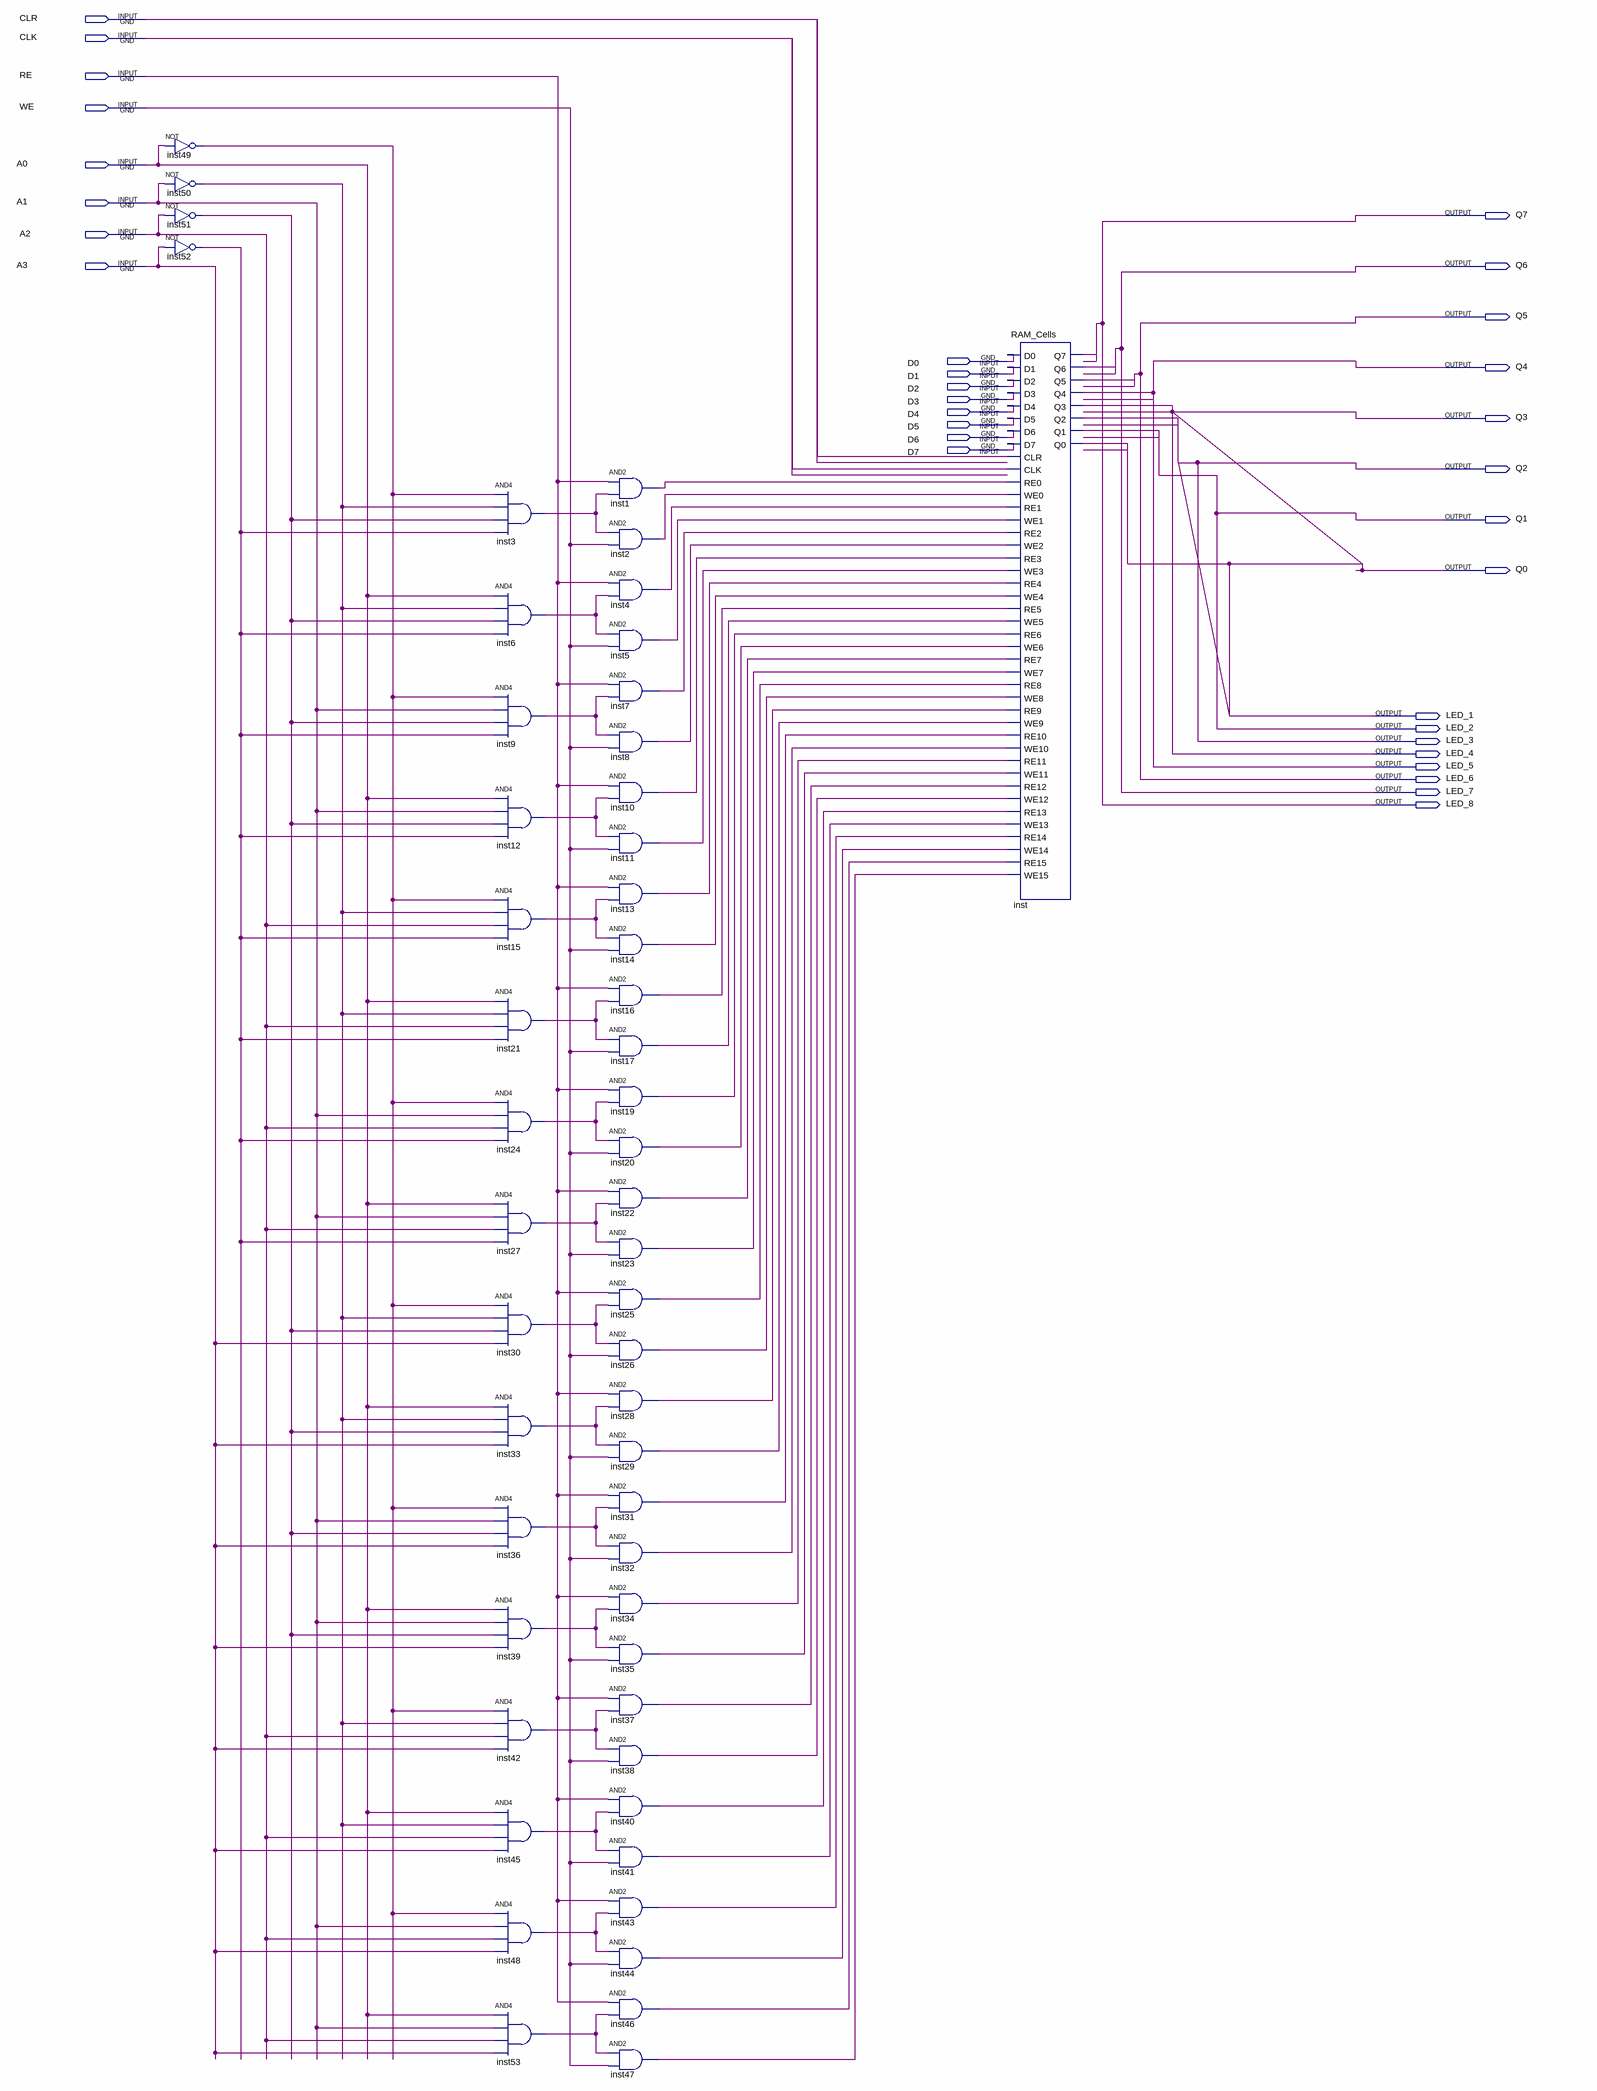
[diagram p0: schematic sheet]
// Quartus schematic RAM.bdf as structural Verilog: 53 symbols, 32 pins
module RAM (
  input  CLR,
  input  CLK,
  input  RE,
  input  WE,
  input  A0,
  input  A1,
  input  A2,
  input  A3,
  input  D0,
  input  D1,
  input  D2,
  input  D3,
  input  D4,
  input  D5,
  input  D6,
  input  D7,
  output Q7,
  output Q6,
  output Q5,
  output Q4,
  output Q3,
  output Q2,
  output Q1,
  output Q0,
  output LED_1,
  output LED_2,
  output LED_3,
  output LED_4,
  output LED_5,
  output LED_6,
  output LED_7,
  output LED_8
);

  wire inst1_out, inst2_out, inst3_out, inst4_out, inst5_out, inst6_out, inst7_out, inst8_out, inst9_out,
       inst10_out, inst11_out, inst12_out, inst13_out, inst14_out, inst15_out, inst16_out, inst17_out,
       inst19_out, inst20_out, inst21_out, inst22_out, inst23_out, inst24_out, inst25_out, inst26_out,
       inst27_out, inst28_out, inst29_out, inst30_out, inst31_out, inst32_out, inst33_out, inst34_out,
       inst35_out, inst36_out, inst37_out, inst38_out, inst39_out, inst40_out, inst41_out, inst42_out,
       inst43_out, inst44_out, inst45_out, inst46_out, inst47_out, inst48_out, inst49_out, inst50_out,
       inst51_out, inst52_out, inst53_out;

  not inst49 (inst49_out, A0);
  not inst50 (inst50_out, A1);
  not inst51 (inst51_out, A2);
  not inst52 (inst52_out, A3);
  and inst3 (inst3_out, inst49_out, inst50_out, inst51_out, inst52_out);
  and inst6 (inst6_out, A0, inst50_out, inst51_out, inst52_out);
  and inst9 (inst9_out, inst49_out, A1, inst51_out, inst52_out);
  and inst12 (inst12_out, A0, A1, inst51_out, inst52_out);
  and inst15 (inst15_out, inst49_out, inst50_out, A2, inst52_out);
  and inst21 (inst21_out, A0, inst50_out, A2, inst52_out);
  and inst24 (inst24_out, inst49_out, A1, A2, inst52_out);
  and inst27 (inst27_out, A0, A1, A2, inst52_out);
  and inst30 (inst30_out, inst49_out, inst50_out, inst51_out, A3);
  and inst33 (inst33_out, A0, inst50_out, inst51_out, A3);
  and inst36 (inst36_out, inst49_out, A1, inst51_out, A3);
  and inst39 (inst39_out, A0, A1, inst51_out, A3);
  and inst42 (inst42_out, inst49_out, inst50_out, A2, A3);
  and inst45 (inst45_out, A0, inst50_out, A2, A3);
  and inst48 (inst48_out, inst49_out, A1, A2, A3);
  and inst53 (inst53_out, A0, A1, A2, A3);
  and inst1 (inst1_out, RE, inst3_out);
  and inst2 (inst2_out, inst3_out, WE);
  and inst4 (inst4_out, RE, inst6_out);
  and inst5 (inst5_out, inst6_out, WE);
  and inst7 (inst7_out, RE, inst9_out);
  and inst8 (inst8_out, inst9_out, WE);
  and inst10 (inst10_out, RE, inst12_out);
  and inst11 (inst11_out, inst12_out, WE);
  and inst13 (inst13_out, RE, inst15_out);
  and inst14 (inst14_out, inst15_out, WE);
  and inst16 (inst16_out, RE, inst21_out);
  and inst17 (inst17_out, inst21_out, WE);
  and inst19 (inst19_out, RE, inst24_out);
  and inst20 (inst20_out, inst24_out, WE);
  and inst22 (inst22_out, RE, inst27_out);
  and inst23 (inst23_out, inst27_out, WE);
  and inst25 (inst25_out, RE, inst30_out);
  and inst26 (inst26_out, inst30_out, WE);
  and inst28 (inst28_out, RE, inst33_out);
  and inst29 (inst29_out, inst33_out, WE);
  and inst31 (inst31_out, RE, inst36_out);
  and inst32 (inst32_out, inst36_out, WE);
  and inst34 (inst34_out, RE, inst39_out);
  and inst35 (inst35_out, inst39_out, WE);
  and inst37 (inst37_out, RE, inst42_out);
  and inst38 (inst38_out, inst42_out, WE);
  and inst40 (inst40_out, RE, inst45_out);
  and inst41 (inst41_out, inst45_out, WE);
  and inst43 (inst43_out, RE, inst48_out);
  and inst44 (inst44_out, inst48_out, WE);
  and inst46 (inst46_out, RE, inst53_out);
  and inst47 (inst47_out, inst53_out, WE);
  RAM_Cells inst (
    .D0(D0), .D1(D1), .D2(D2), .D3(D3), .D4(D4), .D5(D5), .D6(D6), .D7(D7), .CLR(CLR), .CLK(CLK),
    .RE0(inst1_out), .WE0(inst2_out), .RE1(inst4_out), .WE1(inst5_out), .RE2(inst7_out), .WE2(inst8_out),
    .RE3(inst10_out), .WE3(inst11_out), .RE4(inst13_out), .WE4(inst14_out), .RE5(inst16_out),
    .WE5(inst17_out), .RE6(inst19_out), .WE6(inst20_out), .RE7(inst22_out), .WE7(inst23_out),
    .RE8(inst25_out), .WE8(inst26_out), .RE9(inst28_out), .WE9(inst29_out), .RE10(inst31_out),
    .WE10(inst32_out), .RE11(inst34_out), .WE11(inst35_out), .RE12(inst37_out), .WE12(inst38_out),
    .RE13(inst40_out), .WE13(inst41_out), .RE14(inst43_out), .WE14(inst44_out), .RE15(inst46_out),
    .WE15(inst47_out), .Q7(LED_8), .Q6(LED_7), .Q5(LED_6), .Q4(LED_5), .Q3(LED_1), .Q2(LED_1), .Q1(LED_2),
    .Q0(LED_1));

  assign LED_3 = LED_1;
  assign LED_4 = LED_1;
  assign Q0 = LED_1;
  assign Q1 = LED_2;
  assign Q2 = LED_1;
  assign Q3 = LED_1;
  assign Q4 = LED_5;
  assign Q5 = LED_6;
  assign Q6 = LED_7;
  assign Q7 = LED_8;
endmodule
